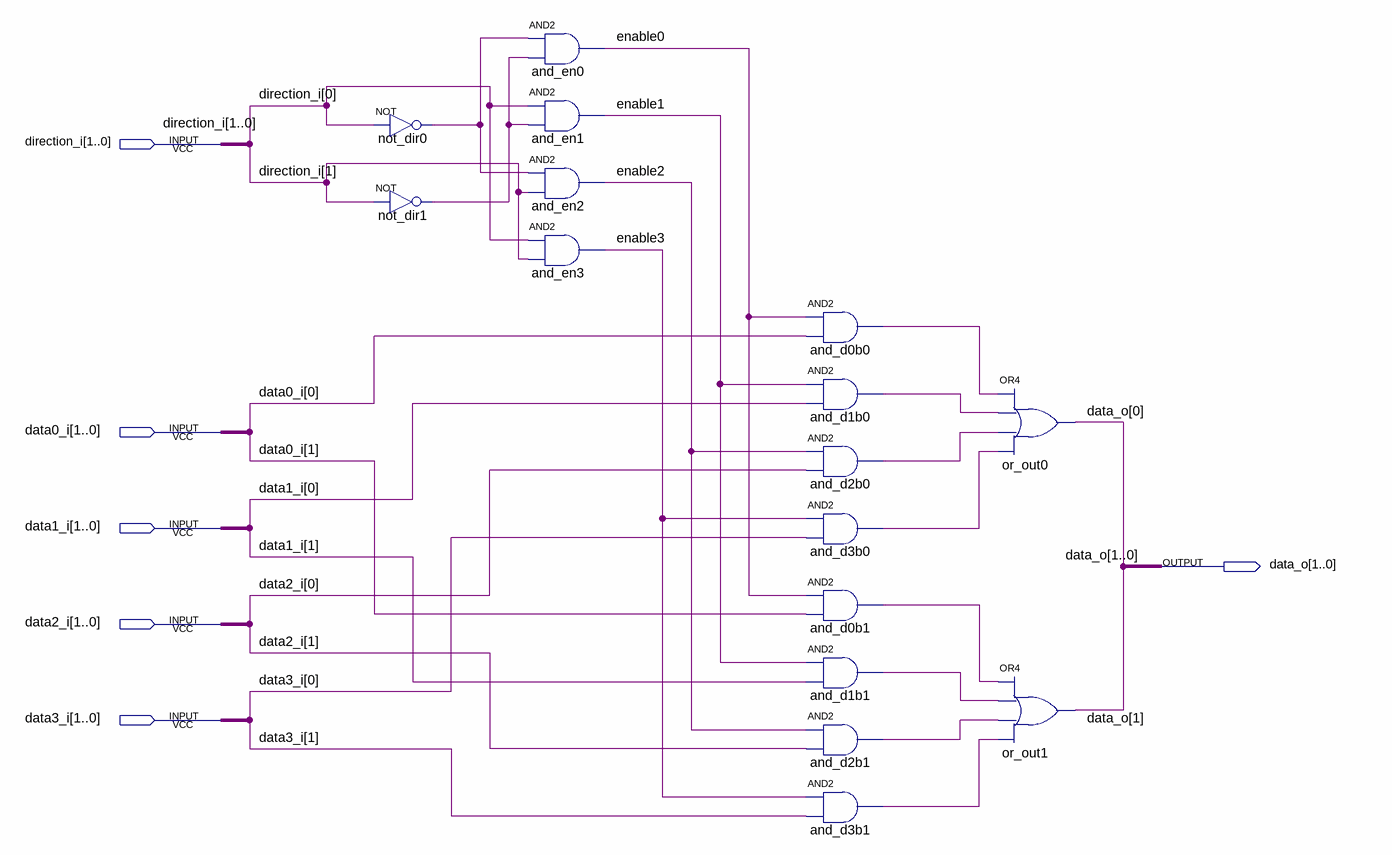
[diagram p0: schematic sheet]
// Quartus schematic mux.bdf as structural Verilog: 16 symbols, 6 pins
module mux (
  input  [1:0] direction_i,
  input  [1:0] data0_i,
  input  [1:0] data1_i,
  input  [1:0] data2_i,
  input  [1:0] data3_i,
  output [1:0] data_o
);

  wire and_d0b0_out, and_d0b1_out, and_d1b0_out, and_d1b1_out, and_d2b0_out, and_d2b1_out, and_d3b0_out,
       and_d3b1_out, enable0, enable1, enable2, enable3, not_dir0_out, not_dir1_out;

  not not_dir0 (not_dir0_out, direction_i[0]);
  not not_dir1 (not_dir1_out, direction_i[1]);
  and and_en0 (enable0, not_dir0_out, not_dir1_out);
  and and_en1 (enable1, direction_i[0], not_dir1_out);
  and and_en2 (enable2, not_dir0_out, direction_i[1]);
  and and_en3 (enable3, direction_i[0], direction_i[1]);
  and and_d0b0 (and_d0b0_out, enable0, data0_i[0]);
  and and_d1b0 (and_d1b0_out, enable1, data1_i[0]);
  and and_d2b0 (and_d2b0_out, enable2, data2_i[0]);
  and and_d3b0 (and_d3b0_out, enable3, data3_i[0]);
  and and_d0b1 (and_d0b1_out, enable0, data0_i[1]);
  and and_d1b1 (and_d1b1_out, enable1, data1_i[1]);
  and and_d2b1 (and_d2b1_out, enable2, data2_i[1]);
  and and_d3b1 (and_d3b1_out, enable3, data3_i[1]);
  or or_out0 (data_o[0], and_d0b0_out, and_d1b0_out, and_d2b0_out, and_d3b0_out);
  or or_out1 (data_o[1], and_d0b1_out, and_d1b1_out, and_d2b1_out, and_d3b1_out);
endmodule
